# Altium project Z80Console.PrjPcb
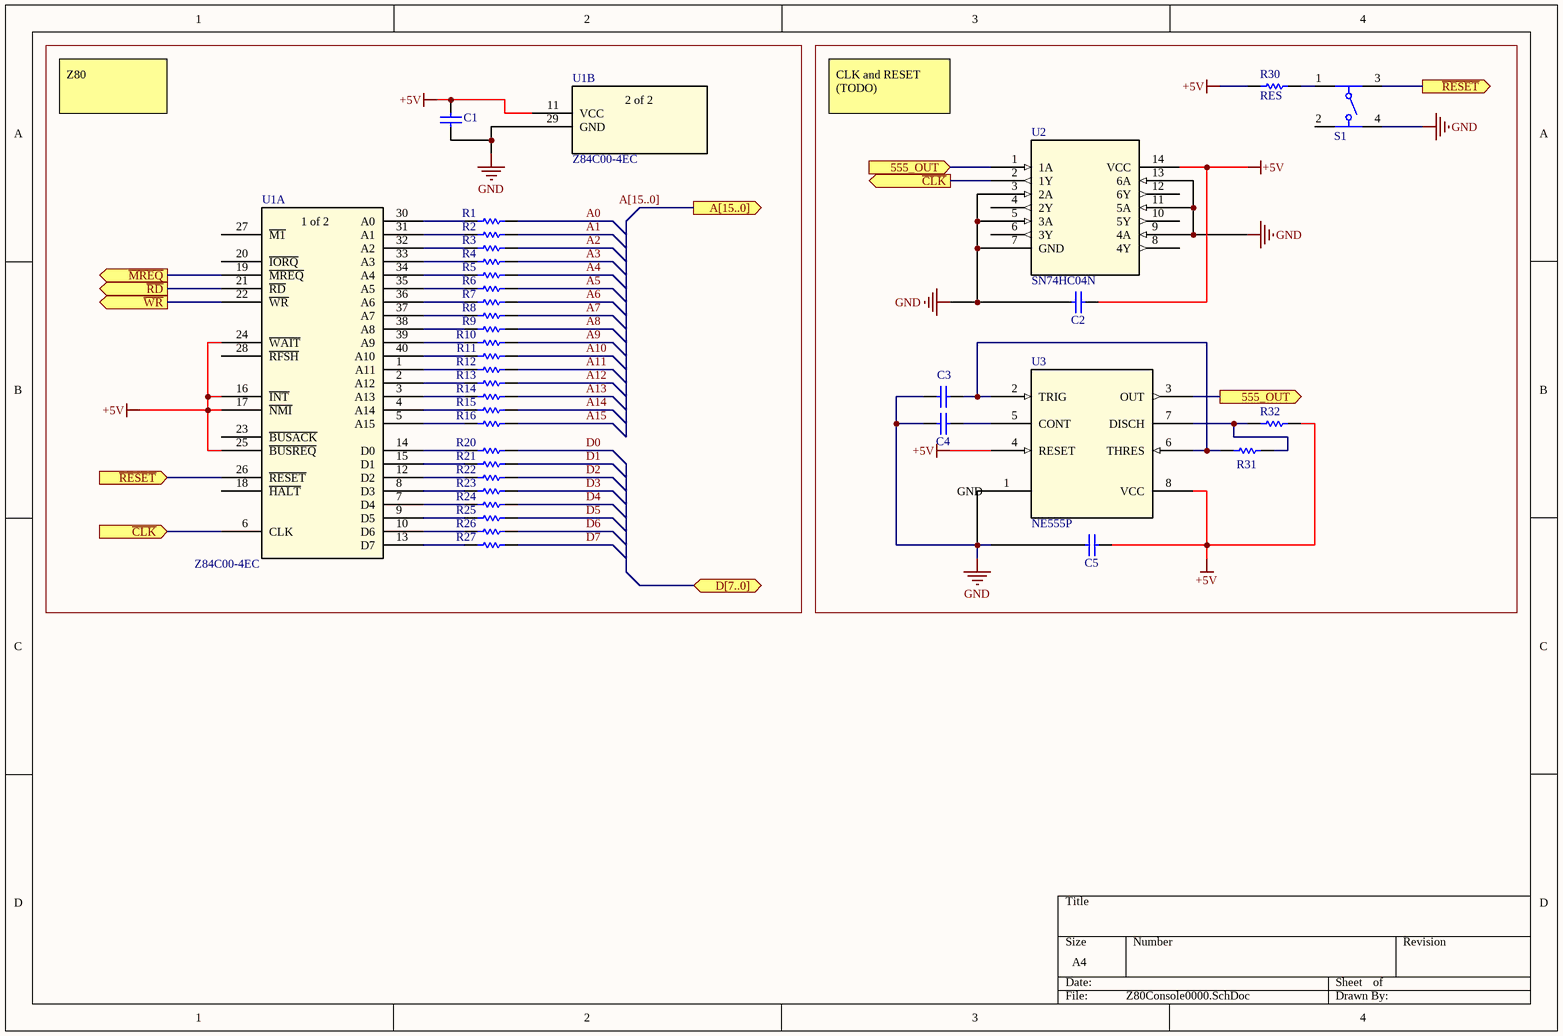
[diagram p0: Z80Console0000.SchDoc]
3 sheets, 60 parts. Net scope: flat (ports and power ports of the same name join across sheets).
Sheets:
  Z80Console0000.SchDoc
  Z80Console0001.SchDoc
  Z80Console0002.SchDoc

## Sheet Z80Console0000.SchDoc
size A4; SheetNumber: 1; SheetTotal: 3

### Parts
C1  CAP  [CAPC0603(1608)100_N]  (value not drawn)
C2  CAP  [CAPC0603(1608)100_N]  (value not drawn)
C3  CAP  [CAPC0603(1608)100_N]  (value not drawn)
C4  CAP  [CAPC0603(1608)100_N]  (value not drawn)
C5  CAP  [CAPC0603(1608)100_N]  (value not drawn)
R1  RES  [RES_2512_MELF]  (value not drawn)
R2  RES  [RES_2512_MELF]  (value not drawn)
R3  RES  [RES_2512_MELF]  (value not drawn)
R4  RES  [RES_2512_MELF]  (value not drawn)
R5  RES  [RES_2512_MELF]  (value not drawn)
R6  RES  [RES_2512_MELF]  (value not drawn)
R7  RES  [RES_2512_MELF]  (value not drawn)
R8  RES  [RES_2512_MELF]  (value not drawn)
R9  RES  [RES_2512_MELF]  (value not drawn)
R10  RES  [RES_2512_MELF]  (value not drawn)
R11  RES  [RES_2512_MELF]  (value not drawn)
R12  RES  [RES_2512_MELF]  (value not drawn)
R13  RES  [RES_2512_MELF]  (value not drawn)
R14  RES  [RES_2512_MELF]  (value not drawn)
R15  RES  [RES_2512_MELF]  (value not drawn)
R16  RES  [RES_2512_MELF]  (value not drawn)
R20  RES  [RES_2512_MELF]  (value not drawn)
R21  RES  [RES_2512_MELF]  (value not drawn)
R22  RES  [RES_2512_MELF]  (value not drawn)
R23  RES  [RES_2512_MELF]  (value not drawn)
R24  RES  [RES_2512_MELF]  (value not drawn)
R25  RES  [RES_2512_MELF]  (value not drawn)
R26  RES  [RES_2512_MELF]  (value not drawn)
R27  RES  [RES_2512_MELF]  (value not drawn)
R30  RES  [RES_2512_MELF]
R31  RES  [RES_2512_MELF]  (value not drawn)
R32  RES  [RES_2512_MELF]  (value not drawn)
S1  430156043726  [4301x60437x6_6x6x4.3]  (value not drawn)
U1  Z84C00-4EC  [DIP40_600_ZIL]  (parts A,B of 2)
U2  SN74HC04N  [N14]
U3  NE555P  [P8]

### Ports
555_OUT (in, see Z80Console0000[4B]), 555_OUT (out, see Z80Console0000[3A]), A[15..0] (out, see Z80Console0001[1B], Z80Console0001[1D], Z80Console0001[3A], Z80Console0001[3C], Z80Console0002[1A], Z80Console0002[2C], Z80Console0002[3A], Z80Console0002[5A]), D[7..0] (bidir, see Z80Console0001[2B], Z80Console0001[2C], Z80Console0002[1C]), ~{CLK} (in, see Z80Console0000[3A]), ~{CLK} (out, see Z80Console0000[1C]), ~{MREQ} (out, see Z80Console0001[5A], Z80Console0001[5C]), ~{RD} (out, see Z80Console0001[5A]), ~{RESET} (in, see Z80Console0000[4A]), ~{RESET} (out, see Z80Console0000[1B]), ~{WR} (out, see Z80Console0001[2C], Z80Console0002[5C])

### Nets
+5V: C1.2 C2.1 C5.2 R30.2 R32.1 U1.11(VCC) U1.16(~{INT}) U1.17(~{NMI}) U1.24(~{WAIT}) U1.25(~{BUSREQ}) U2.14(VCC) U3.4(RESET) U3.8(VCC)
GND: C1.1 C2.2 C3.2 C4.2 C5.1 S1.4 U1.29(GND) U2.3(2A) U2.5(3A) U2.7(GND) U2.9(4A) U2.11(5A) U2.13(6A)
A0: R1.1
A1: R2.1
A2: R3.1
A3: R4.1
A4: R5.1
A5: R6.1
A6: R7.1
A7: R8.1
A8: R9.1
A9: R10.1
A10: R11.1
A11: R12.1
A12: R13.1
A13: R14.1
A14: R15.1
A15: R16.1
D0: R20.1
D1: R21.1
D2: R22.1
D3: R23.1
D4: R24.1
D5: R25.1
D6: R26.1
D7: R27.1
NetC3_1: C3.1 R31.2 U3.2(TRIG) U3.6(THRES)
NetC4_1: C4.1 U3.5(CONT)
NetR1_2: R1.2 U1.30(A0)
NetR2_2: R2.2 U1.31(A1)
NetR3_2: R3.2 U1.32(A2)
NetR4_2: R4.2 U1.33(A3)
NetR5_2: R5.2 U1.34(A4)
NetR6_2: R6.2 U1.35(A5)
NetR7_2: R7.2 U1.36(A6)
NetR8_2: R8.2 U1.37(A7)
NetR9_2: R9.2 U1.38(A8)
NetR10_2: R10.2 U1.39(A9)
NetR11_2: R11.2 U1.40(A10)
NetR12_2: R12.2 U1.1(A11)
NetR13_2: R13.2 U1.2(A12)
NetR14_2: R14.2 U1.3(A13)
NetR15_2: R15.2 U1.4(A14)
NetR16_2: R16.2 U1.5(A15)
NetR20_2: R20.2 U1.14(D0)
NetR21_2: R21.2 U1.15(D1)
NetR22_2: R22.2 U1.12(D2)
NetR23_2: R23.2 U1.8(D3)
NetR24_2: R24.2 U1.7(D4)
NetR25_2: R25.2 U1.9(D5)
NetR26_2: R26.2 U1.10(D6)
NetR27_2: R27.2 U1.13(D7)
NetR30_1: R30.1 S1.1
NetR31_1: R31.1 R32.2 U3.7(DISCH)
NetS1_3: S1.3 U1.26(~{RESET}) ; port ~{RESET}
NetU1_6: U1.6(CLK) U2.2(1Y) ; port ~{CLK}
NetU1_19: U1.19(~{MREQ}) ; port ~{MREQ}
NetU1_21: U1.21(~{RD}) ; port ~{RD}
NetU1_22: U1.22(~{WR}) ; port ~{WR}
NetU2_1: U2.1(1A) U3.3(OUT) ; port 555_OUT

Not connected (* = marked no-connect by the designer): S1 2; U1 18(~{HALT}) 20(~{IORQ}) 23(~{BUSACK}) 27(~{M1}) 28(~{RFSH}); U2 4(2Y) 6(3Y) 8(4Y) 10(5Y) 12(6Y); U3 1(GND)

### Buses and harness runs
bus A[15..0] = port A[15..0]

### Notes on the sheet
- Z80
- CLK and RESET
  (TODO)
- (in symbol Z84C00-4EC, part A) 1 of 2
- (in symbol Z84C00-4EC, part B) 2 of 2

### Library data of the parts
S1 = 430156043726: WS-TATV 6x6mm Tact Switch, THT version; Operation Force: 260g; ComponentLink1Description: Manufacturer; ComponentLink1URL: http://www.we-online.de; ComponentLink2Description: Datasheet; ComponentLink2URL: http://katalog.we-online.de/em/datasheet/4301x6xxx7x6.pdf; Part Number: 430156043726; Published Date: June 2017; Publisher: Wurth Elektronik; Size: 6x6x4.3 mm; Life Cycle: 200000 cycles
U1 = Z84C00-4EC: No Description Available; Manufacturer_Name: Littelfuse Inc; Copyright: Copyright (C) 2025 Ultra Librarian. All rights reserved.; Manufacturer_Part_Number: Z84C00-4EC; RefDes: RefDes; Type: Type
U2 = SN74HC04N: 6-ch, 2-V to 6-V inverters 14-PDIP -40 to 85; Manufacturer_Name: Texas Instruments; Copyright: Copyright (C) 2025 Ultra Librarian. All rights reserved.; Manufacturer_Part_Number: SN74HC04N; Datasheet: https://www.ti.com/lit/gpn/sn74hc04; RefDes: RefDes; Type: Type
U3 = NE555P: Single Precision Timer 8-PDIP 0 to 70; Manufacturer_Name: Texas Instruments; Copyright: Copyright (C) 2025 Ultra Librarian. All rights reserved.; Manufacturer_Part_Number: NE555P; Datasheet: https://www.ti.com/lit/gpn/ne555; RefDes: RefDes; Type: Type

## Sheet Z80Console0001.SchDoc
size 381 x 241 mm; SheetNumber: 2; SheetTotal: 3
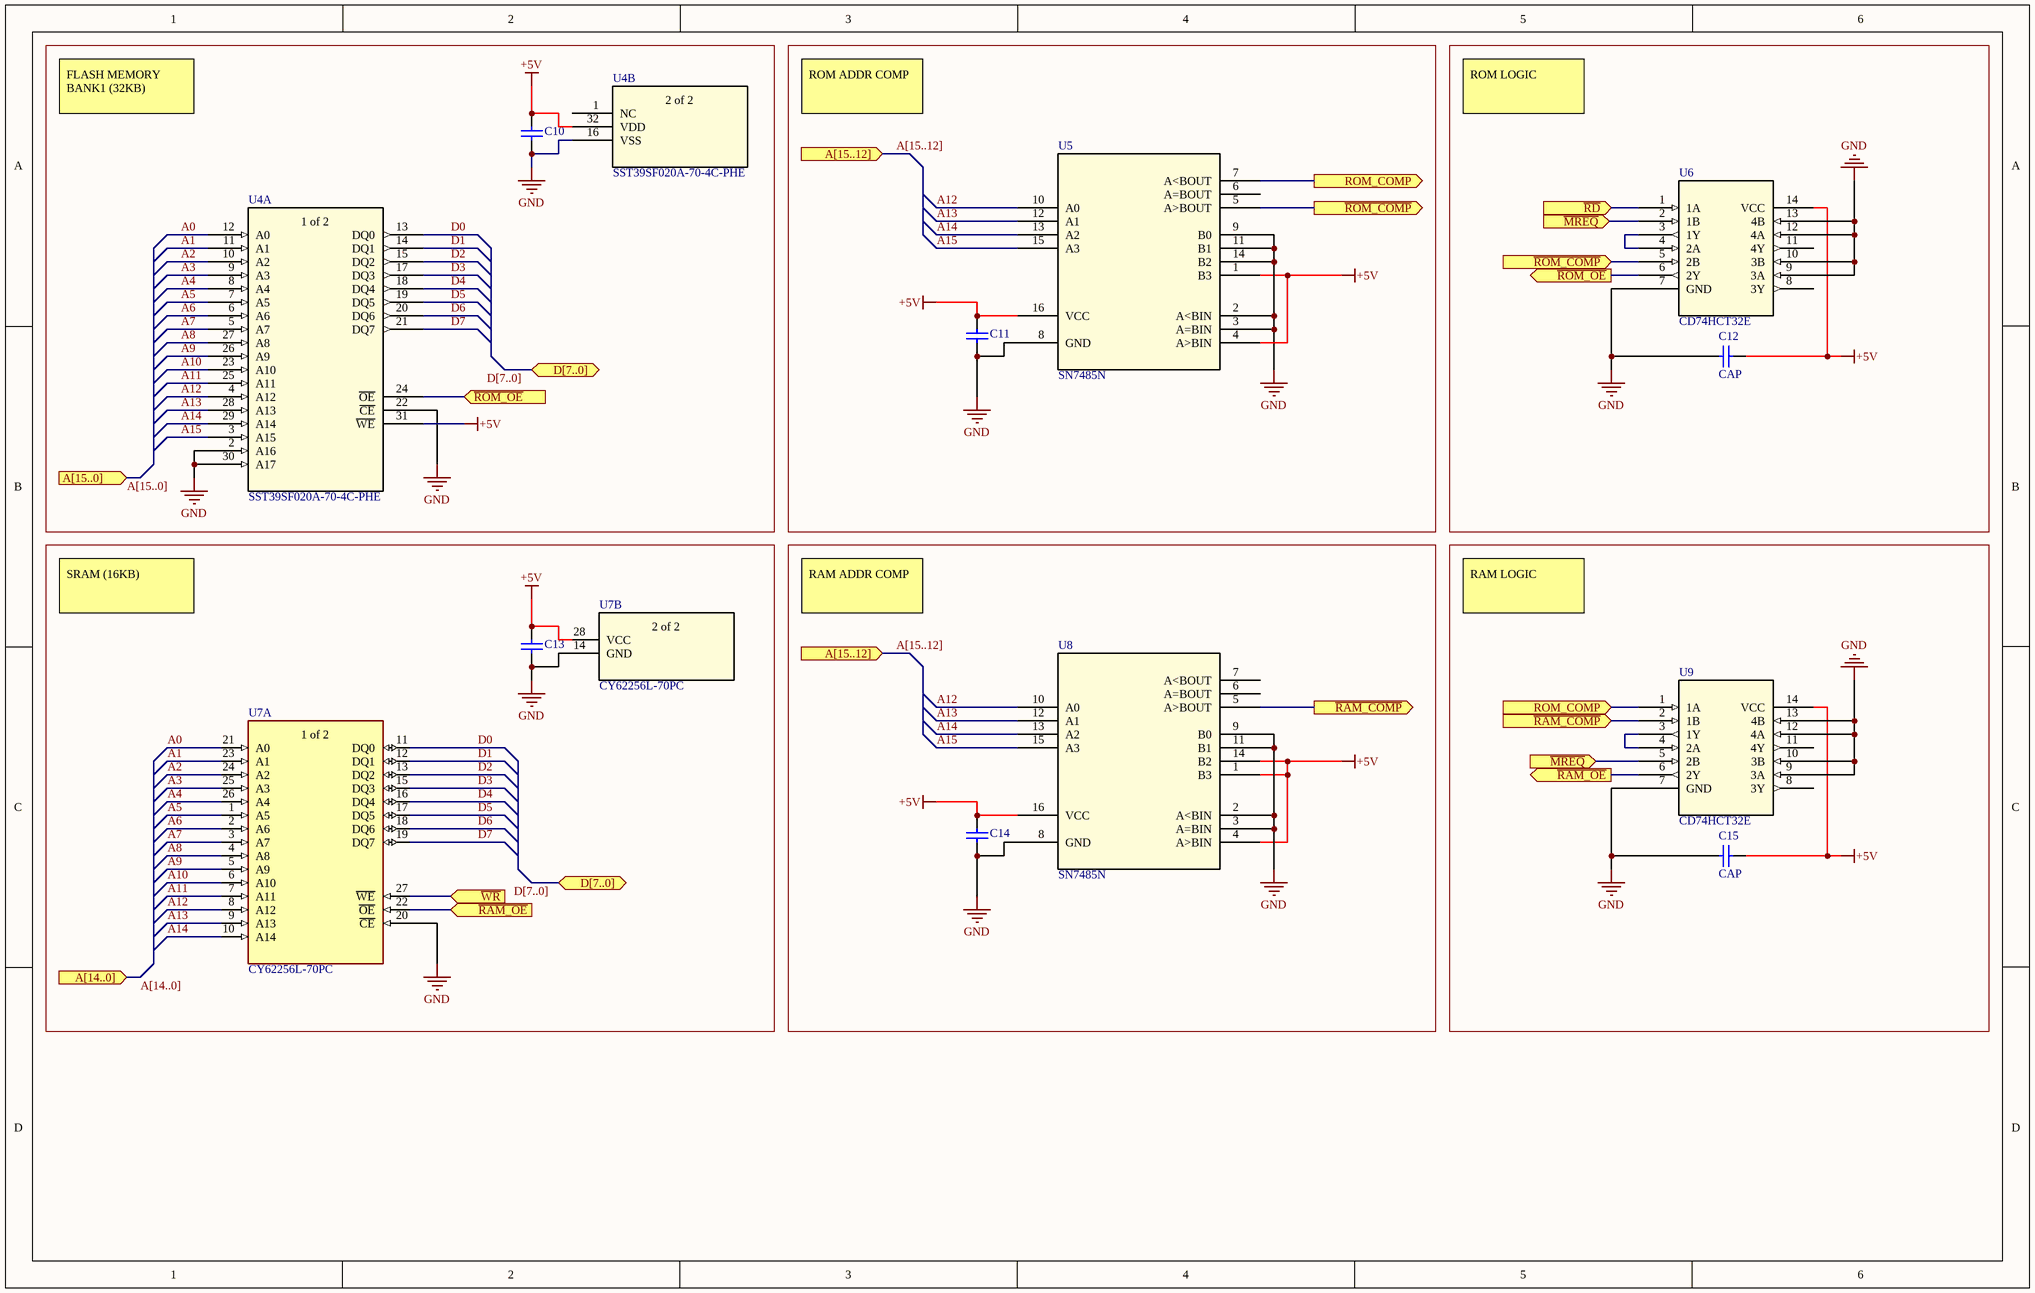
[diagram p1: Z80Console0001.SchDoc]

### Parts
C10  CAP  [CAPC0603(1608)100_N]  (value not drawn)
C11  CAP  [CAPC0603(1608)100_N]  (value not drawn)
C12  CAP  [CAPC0603(1608)100_N]
C13  CAP  [CAPC0603(1608)100_N]  (value not drawn)
C14  CAP  [CAPC0603(1608)100_N]  (value not drawn)
C15  CAP  [CAPC0603(1608)100_N]
U4  SST39SF020A-70-4C-PHE  [PDIP32_PH_SST_MCH]  (parts A,B of 2)
U5  SN7485N  [DIP16_300]
U6  CD74HCT32E  [N14]
U7  CY62256L-70PC  [DIP1587W140P254L3632H381Q28N]  (parts A,B of 2)
U8  SN7485N  [DIP16_300]
U9  CD74HCT32E  [N14]

### Ports
A[14..0] (in, see Z80Console0000[2A], Z80Console0001[1B], Z80Console0001[3A], Z80Console0001[3C], Z80Console0002[1A], Z80Console0002[2C], Z80Console0002[3A], Z80Console0002[5A]), A[15..0] (in, see Z80Console0000[2A], Z80Console0001[1D], Z80Console0001[3A], Z80Console0001[3C], Z80Console0002[1A], Z80Console0002[2C], Z80Console0002[3A], Z80Console0002[5A]), A[15..12] (in, see Z80Console0000[2A], Z80Console0001[1B], Z80Console0001[1D], Z80Console0001[3A], Z80Console0002[1A]), A[15..12] (in, see Z80Console0000[2A], Z80Console0001[1B], Z80Console0001[1D], Z80Console0001[3C], Z80Console0002[1A]), D[7..0] (bidir, see Z80Console0000[2C], Z80Console0001[2B], Z80Console0002[1C]), D[7..0] (bidir, see Z80Console0000[2C], Z80Console0001[2C], Z80Console0002[1C]), ROM_COMP (in, see Z80Console0001[4A]), ROM_COMP (out, see Z80Console0001[5C]), ~{MREQ} (in, see Z80Console0000[1B], Z80Console0001[5A]), ~{MREQ} (in, see Z80Console0000[1B], Z80Console0001[5C]), ~{RAM_COMP} (in, see Z80Console0001[4C]), ~{RAM_COMP} (out, see Z80Console0001[5C]), ~{RAM_OE} (in, see Z80Console0001[5C]), ~{RAM_OE} (out, see Z80Console0001[2C]), ~{RD} (in, see Z80Console0000[1B]), ~{ROM_COMP} (in, see Z80Console0001[4A]), ~{ROM_COMP} (out, see Z80Console0001[5A]), ~{ROM_OE} (in, see Z80Console0001[5A]), ~{ROM_OE} (out, see Z80Console0001[2B]), ~{WR} (in, see Z80Console0000[1B], Z80Console0002[5C])

### Nets
+5V: C10.2 C11.2 C12.2 C13.2 C14.2 C15.2 U4.31(~{WE}) U4.32(VDD) U5.1(B3) U5.4(A>BIN) U5.16(VCC) U6.14(VCC) U7.28(VCC) U8.1(B3) U8.4(A>BIN) U8.14(B2) U8.16(VCC) U9.14(VCC)
GND: C10.1 C11.1 C12.1 C13.1 C14.1 C15.1 U4.2(A16) U4.16(VSS) U4.22(~{CE}) U4.30(A17) U5.2(A<BIN) U5.3(A=BIN) U5.8(GND) U5.9(B0) U5.11(B1) U5.14(B2) U6.7(GND) U6.9(3A) U6.10(3B) U6.12(4A) U6.13(4B) U7.14(GND) U7.20(~{CE}) U8.2(A<BIN) U8.3(A=BIN) U8.8(GND) U8.9(B0) U8.11(B1) U9.7(GND) U9.9(3A) U9.10(3B) U9.12(4A) U9.13(4B)
A0: U4.12(A0) U7.21(A0)
A1: U4.11(A1) U7.23(A1)
A2: U4.10(A2) U7.24(A2)
A3: U4.9(A3) U7.25(A3)
A4: U4.8(A4) U7.26(A4)
A5: U4.7(A5) U7.1(A5)
A6: U4.6(A6) U7.2(A6)
A7: U4.5(A7) U7.3(A7)
A8: U4.27(A8) U7.4(A8)
A9: U4.26(A9) U7.5(A9)
A10: U4.23(A10) U7.6(A10)
A11: U4.25(A11) U7.7(A11)
A12: U4.4(A12) U5.10(A0) U7.8(A12) U8.10(A0)
A13: U4.28(A13) U5.12(A1) U7.9(A13) U8.12(A1)
A14: U4.29(A14) U5.13(A2) U7.10(A14) U8.13(A2)
A15: U4.3(A15) U5.15(A3) U8.15(A3)
D0: U4.13(DQ0) U7.11(DQ0)
D1: U4.14(DQ1) U7.12(DQ1)
D2: U4.15(DQ2) U7.13(DQ2)
D3: U4.17(DQ3) U7.15(DQ3)
D4: U4.18(DQ4) U7.16(DQ4)
D5: U4.19(DQ5) U7.17(DQ5)
D6: U4.20(DQ6) U7.18(DQ6)
D7: U4.21(DQ7) U7.19(DQ7)
NetU1_19: U6.2(1B) U9.5(2B) ; port ~{MREQ}
NetU1_21: U6.1(1A) ; port ~{RD}
NetU1_22: U7.27(~{WE}) ; port ~{WR}
NetU4_24: U4.24(~{OE}) U6.6(2Y) ; port ~{ROM_OE}
NetU5_5: U5.5(A>BOUT) U6.5(2B) ; port ~{ROM_COMP}
NetU5_7: U5.7(A<BOUT) U9.1(1A) ; port ROM_COMP
NetU6_3: U6.3(1Y) U6.4(2A)
NetU7_22: U7.22(~{OE}) U9.6(2Y) ; port ~{RAM_OE}
NetU8_5: U8.5(A>BOUT) U9.2(1B) ; port ~{RAM_COMP}
NetU9_3: U9.3(1Y) U9.4(2A)

Not connected (* = marked no-connect by the designer): U4 1(NC); U5 6(A=BOUT); U6 8(3Y) 11(4Y); U8 6(A=BOUT) 7(A<BOUT); U9 8(3Y) 11(4Y)

### Buses and harness runs
bus A[14..0] = port A[14..0]
bus A[15..0] = port A[15..0]
bus A[15..12] = port A[15..12]
bus D[7..0] = port D[7..0]

### Notes on the sheet
- FLASH MEMORY
  BANK1 (32KB)
- ROM ADDR COMP
- ROM LOGIC
- SRAM (16KB)
- RAM ADDR COMP
- RAM LOGIC
- (in symbol CY62256L-70PC, part A) 1 of 2
- (in symbol CY62256L-70PC, part B) 2 of 2
- (in symbol SST39SF020A-70-4C-PHE, part A) 1 of 2
- (in symbol SST39SF020A-70-4C-PHE, part B) 2 of 2

### Library data of the parts
U4 = SST39SF020A-70-4C-PHE: No Description Available; Manufacturer_Name: Microchip; Copyright: Copyright (C) 2025 Ultra Librarian. All rights reserved.; Manufacturer_Part_Number: SST39SF020A-70-4C-PHE; RefDes: RefDes; Type: Type
U5 U8 = SN7485N: No Description Available; Manufacturer_Name: Texas Instruments; Copyright: Copyright (C) 2025 Ultra Librarian. All rights reserved.; Manufacturer_Part_Number: SN7485N; RefDes: RefDes; Type: Type
U6 U9 = CD74HCT32E: 4-ch 2-input 4.5-V to 5.5-V OR gate with TTL-compatible inputs 14-PDIP -55 to 125; Manufacturer_Name: Texas Instruments; Copyright: Copyright (C) 2025 Ultra Librarian. All rights reserved.; Manufacturer_Part_Number: CD74HCT32E; Datasheet: https://www.ti.com/lit/gpn/cd74hct32; RefDes: RefDes; Type: Type
U7 = CY62256L-70PC: 256K (32K x 8) Static RAM

## Sheet Z80Console0002.SchDoc
size 381 x 266 mm; SheetNumber: 3; SheetTotal: 3
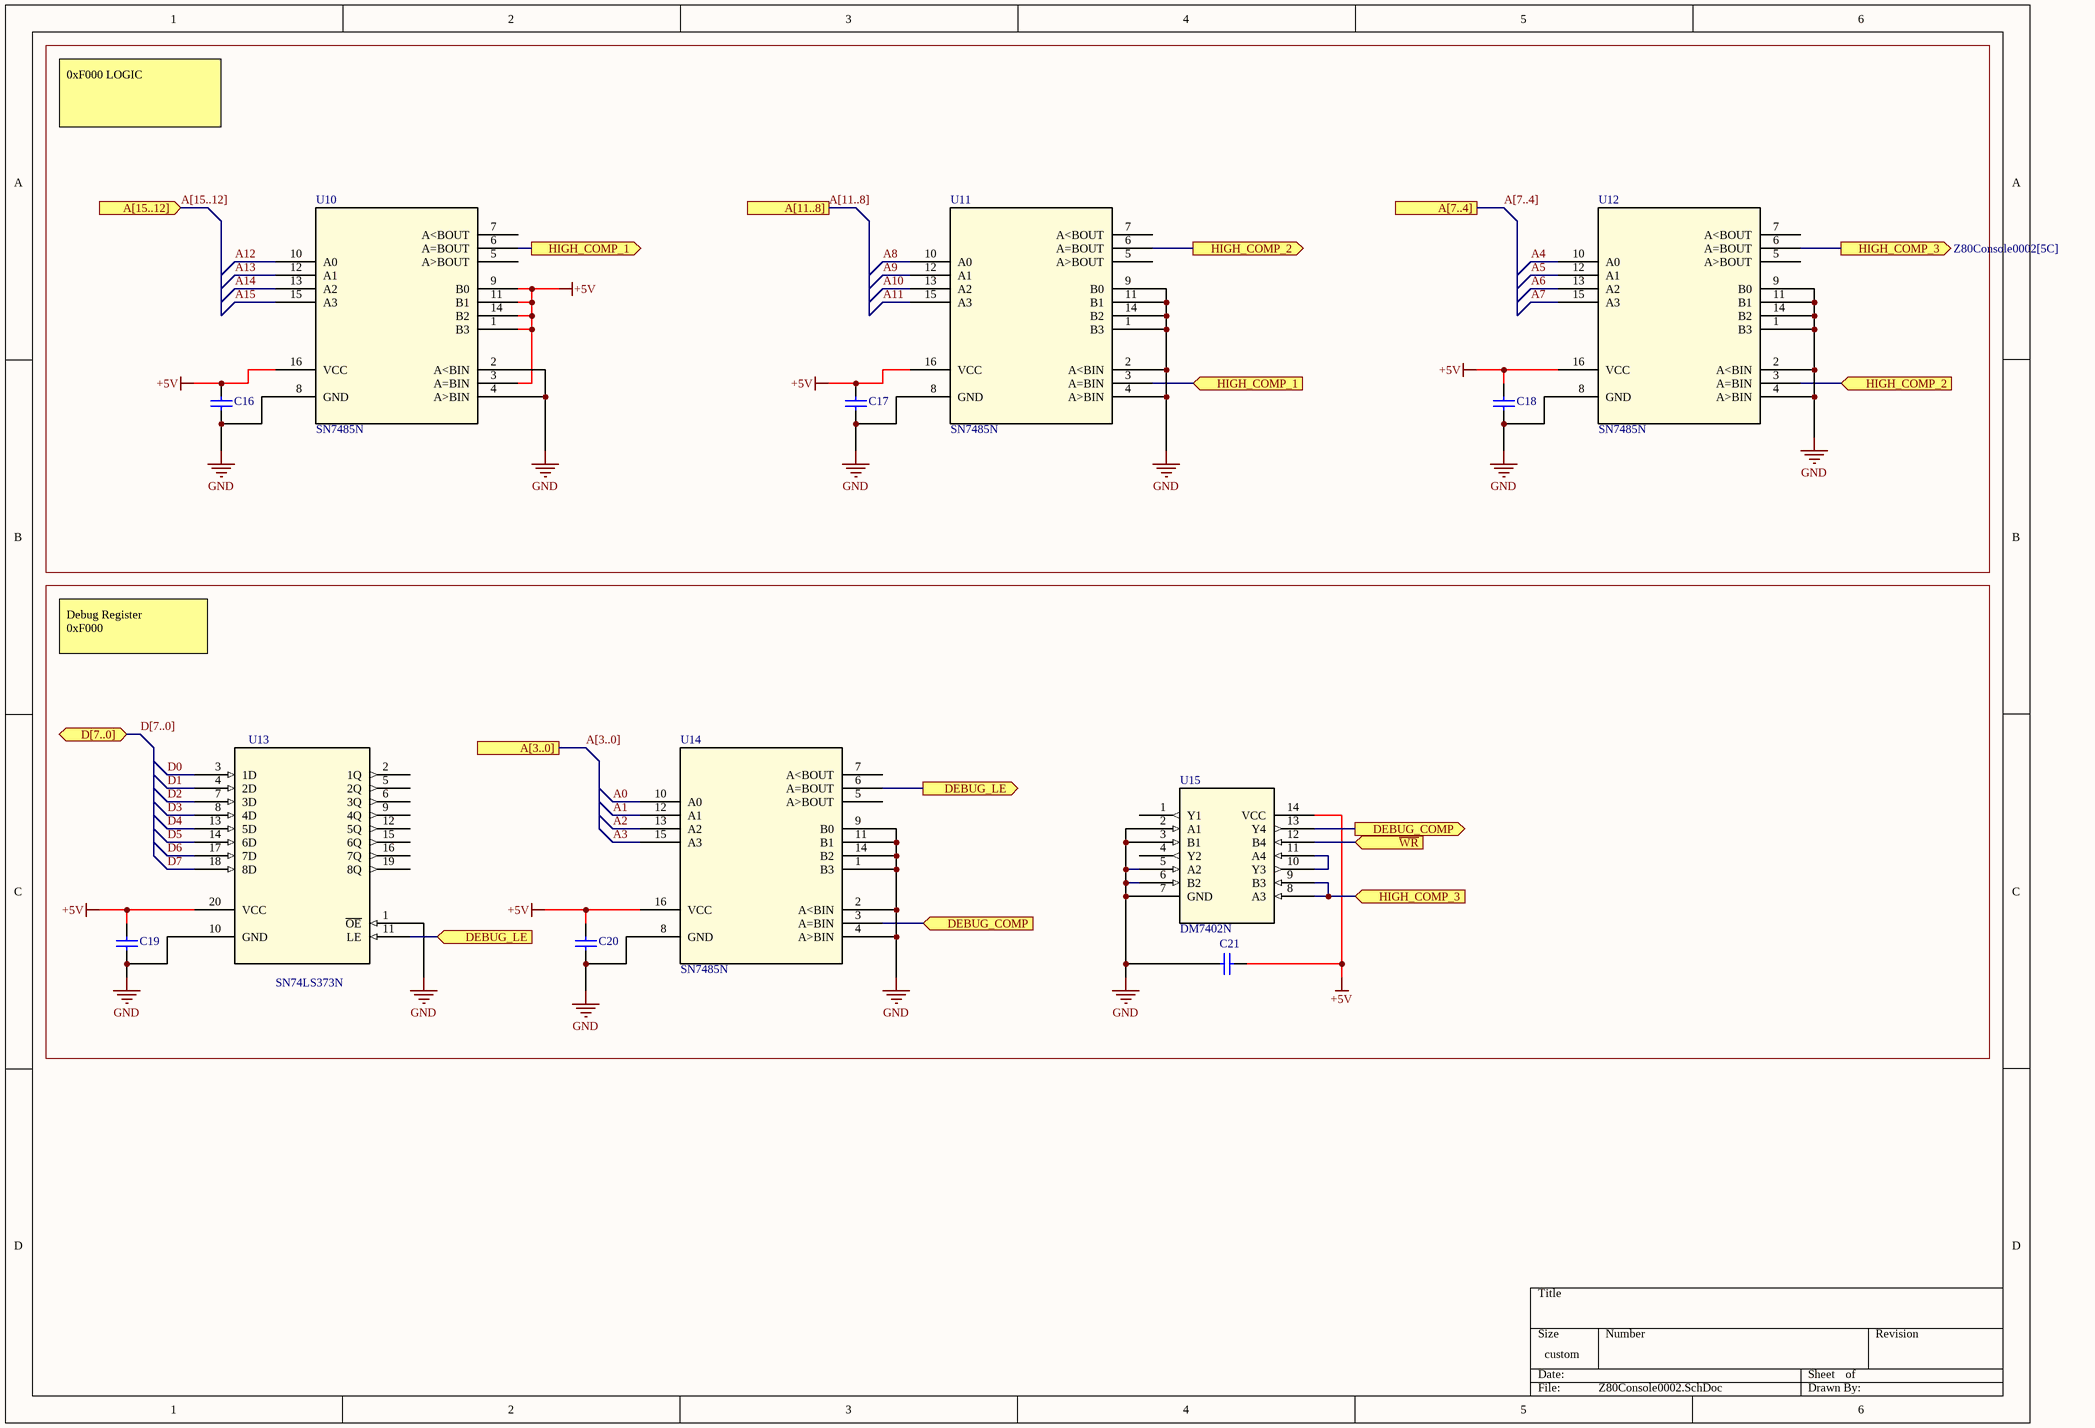
[diagram p2: Z80Console0002.SchDoc]

### Parts
C16  CAP  [CAPC0603(1608)100_N]  (value not drawn)
C17  CAP  [CAPC0603(1608)100_N]  (value not drawn)
C18  CAP  [CAPC0603(1608)100_N]  (value not drawn)
C19  CAP  [CAPC0603(1608)100_N]  (value not drawn)
C20  CAP  [CAPC0603(1608)100_N]  (value not drawn)
C21  CAP  [CAPC0603(1608)100_N]  (value not drawn)
U10  SN7485N  [DIP16_300]
U11  SN7485N  [DIP16_300]
U12  SN7485N  [DIP16_300]
U13  SN74LS373N  [N20]
U14  SN7485N  [DIP16_300]
U15  DM7402N  [PDIP14_19P56X6P35_ONS]

### Ports
A[3..0] (see Z80Console0000[2A], Z80Console0001[1B], Z80Console0001[1D]), A[7..4] (see Z80Console0000[2A], Z80Console0001[1B], Z80Console0001[1D]), A[11..8] (see Z80Console0000[2A], Z80Console0001[1B], Z80Console0001[1D]), A[15..12] (in, see Z80Console0000[2A], Z80Console0001[1B], Z80Console0001[1D], Z80Console0001[3A], Z80Console0001[3C]), D[7..0] (bidir, see Z80Console0000[2C], Z80Console0001[2B], Z80Console0001[2C]), DEBUG_COMP (in, see Z80Console0002[5C]), DEBUG_COMP (out, see Z80Console0002[3C]), DEBUG_LE (in, see Z80Console0002[3C]), DEBUG_LE (out, see Z80Console0002[2C]), HIGH_COMP_1 (in, see Z80Console0002[2A]), HIGH_COMP_1 (out, see Z80Console0002[4B]), HIGH_COMP_2 (in, see Z80Console0002[4A]), HIGH_COMP_2 (out, see Z80Console0002[6B]), HIGH_COMP_3 (in, see Z80Console0002[6A]), HIGH_COMP_3 (out, see Z80Console0002[5C]), ~{WR} (in, see Z80Console0000[1B], Z80Console0001[2C])

### Nets
+5V: C16.2 C17.2 C18.2 C19.2 C20.2 C21.2 U10.1(B3) U10.3(A=BIN) U10.9(B0) U10.11(B1) U10.14(B2) U10.16(VCC) U11.16(VCC) U12.16(VCC) U13.20(VCC) U14.16(VCC) U15.14(VCC)
GND: C16.1 C17.1 C18.1 C19.1 C20.1 C21.1 U10.2(A<BIN) U10.4(A>BIN) U10.8(GND) U11.1(B3) U11.2(A<BIN) U11.4(A>BIN) U11.8(GND) U11.9(B0) U11.11(B1) U11.14(B2) U12.1(B3) U12.2(A<BIN) U12.4(A>BIN) U12.8(GND) U12.9(B0) U12.11(B1) U12.14(B2) U13.1(~{OE}) U13.10(GND) U14.1(B3) U14.2(A<BIN) U14.4(A>BIN) U14.8(GND) U14.9(B0) U14.11(B1) U14.14(B2) U15.2(A1) U15.3(B1) U15.5(A2) U15.6(B2) U15.7(GND)
A0: U14.10(A0)
A1: U14.12(A1)
A2: U14.13(A2)
A3: U14.15(A3)
A4: U12.10(A0)
A5: U12.12(A1)
A6: U12.13(A2)
A7: U12.15(A3)
A8: U11.10(A0)
A9: U11.12(A1)
A10: U11.13(A2)
A11: U11.15(A3)
A12: U10.10(A0)
A13: U10.12(A1)
A14: U10.13(A2)
A15: U10.15(A3)
D0: U13.3(1D)
D1: U13.4(2D)
D2: U13.7(3D)
D3: U13.8(4D)
D4: U13.13(5D)
D5: U13.14(6D)
D6: U13.17(7D)
D7: U13.18(8D)
NetU1_22: U15.12(B4) ; port ~{WR}
NetU10_6: U10.6(A=BOUT) U11.3(A=BIN) ; port HIGH_COMP_1
NetU11_6: U11.6(A=BOUT) U12.3(A=BIN) ; port HIGH_COMP_2
NetU12_6: U12.6(A=BOUT) U15.8(A3) U15.9(B3) ; port HIGH_COMP_3
NetU13_11: U13.11(LE) U14.6(A=BOUT) ; port DEBUG_LE
NetU14_3: U14.3(A=BIN) U15.13(Y4) ; port DEBUG_COMP
NetU15_10: U15.10(Y3) U15.11(A4)

Not connected (* = marked no-connect by the designer): U10 5(A>BOUT) 7(A<BOUT); U11 5(A>BOUT) 7(A<BOUT); U12 5(A>BOUT) 7(A<BOUT); U13 2(1Q) 5(2Q) 6(3Q) 9(4Q) 12(5Q) 15(6Q) 16(7Q) 19(8Q); U14 5(A>BOUT) 7(A<BOUT); U15 1(Y1) 4(Y2)

### Buses and harness runs
bus A[3..0] = port A[3..0]
bus A[7..4] = port A[7..4]
bus A[11..8] = port A[11..8]
bus A[15..12] = port A[15..12]
bus D[7..0] = port D[7..0]

### Notes on the sheet
- 0xF000 LOGIC
- Debug Register
  0xF000

### Library data of the parts
U10-U12 U14 = SN7485N: 4-bit Magnitude Comparator; Manufacturer_Name: Texas Instruments; Copyright: Copyright (C) 2025 Ultra Librarian. All rights reserved.; Manufacturer_Part_Number: SN7485N; RefDes: RefDes; Type: Type
U13 = SN74LS373N: Octal D-type Transparent Latches with 3-state Outputs 20-PDIP 0 to 70; Manufacturer_Name: Texas Instruments; Copyright: Copyright (C) 2025 Ultra Librarian. All rights reserved.; Manufacturer_Part_Number: SN74LS373N; Datasheet: https://www.ti.com/lit/gpn/sn74ls373; RefDes: RefDes; Type: Type
U15 = DM7402N: NOR Gate; Manufacturer_Name: onsemi; Copyright: Copyright (C) 2025 Ultra Librarian. All rights reserved.; Manufacturer_Part_Number: DM7402N; RefDes: RefDes; Type: Type

## Nets that join several sheets
+5V: Z80Console0000 (13 pins), Z80Console0001 (18 pins), Z80Console0002 (17 pins)
GND: Z80Console0000 (13 pins), Z80Console0001 (33 pins), Z80Console0002 (37 pins)
A0: Z80Console0000 (R1.1), Z80Console0001 (U4.12 U7.21)
A1: Z80Console0000 (R2.1), Z80Console0001 (U4.11 U7.23)
A2: Z80Console0000 (R3.1), Z80Console0001 (U4.10 U7.24)
A3: Z80Console0000 (R4.1), Z80Console0001 (U4.9 U7.25)
A4: Z80Console0000 (R5.1), Z80Console0001 (U4.8 U7.26)
A5: Z80Console0000 (R6.1), Z80Console0001 (U4.7 U7.1)
A6: Z80Console0000 (R7.1), Z80Console0001 (U4.6 U7.2)
A7: Z80Console0000 (R8.1), Z80Console0001 (U4.5 U7.3)
A8: Z80Console0000 (R9.1), Z80Console0001 (U4.27 U7.4)
A9: Z80Console0000 (R10.1), Z80Console0001 (U4.26 U7.5)
A10: Z80Console0000 (R11.1), Z80Console0001 (U4.23 U7.6)
A11: Z80Console0000 (R12.1), Z80Console0001 (U4.25 U7.7)
A12: Z80Console0000 (R13.1), Z80Console0001 (U4.4 U5.10 U7.8 U8.10), Z80Console0002 (U10.10)
A13: Z80Console0000 (R14.1), Z80Console0001 (U4.28 U5.12 U7.9 U8.12), Z80Console0002 (U10.12)
A14: Z80Console0000 (R15.1), Z80Console0001 (U4.29 U5.13 U7.10 U8.13), Z80Console0002 (U10.13)
A15: Z80Console0000 (R16.1), Z80Console0001 (U4.3 U5.15 U8.15), Z80Console0002 (U10.15)
D0: Z80Console0001 (U4.13 U7.11), Z80Console0002 (U13.3)
D1: Z80Console0001 (U4.14 U7.12), Z80Console0002 (U13.4)
D2: Z80Console0001 (U4.15 U7.13), Z80Console0002 (U13.7)
D3: Z80Console0001 (U4.17 U7.15), Z80Console0002 (U13.8)
D4: Z80Console0001 (U4.18 U7.16), Z80Console0002 (U13.13)
D5: Z80Console0001 (U4.19 U7.17), Z80Console0002 (U13.14)
D6: Z80Console0001 (U4.20 U7.18), Z80Console0002 (U13.17)
D7: Z80Console0001 (U4.21 U7.19), Z80Console0002 (U13.18)
NetU1_19: Z80Console0000 (U1.19), Z80Console0001 (U6.2 U9.5)
NetU1_21: Z80Console0000 (U1.21), Z80Console0001 (U6.1)
NetU1_22: Z80Console0000 (U1.22), Z80Console0001 (U7.27), Z80Console0002 (U15.12)